# EAGLE design EXDOS rev3.7 (EAGLE 7.5.0)
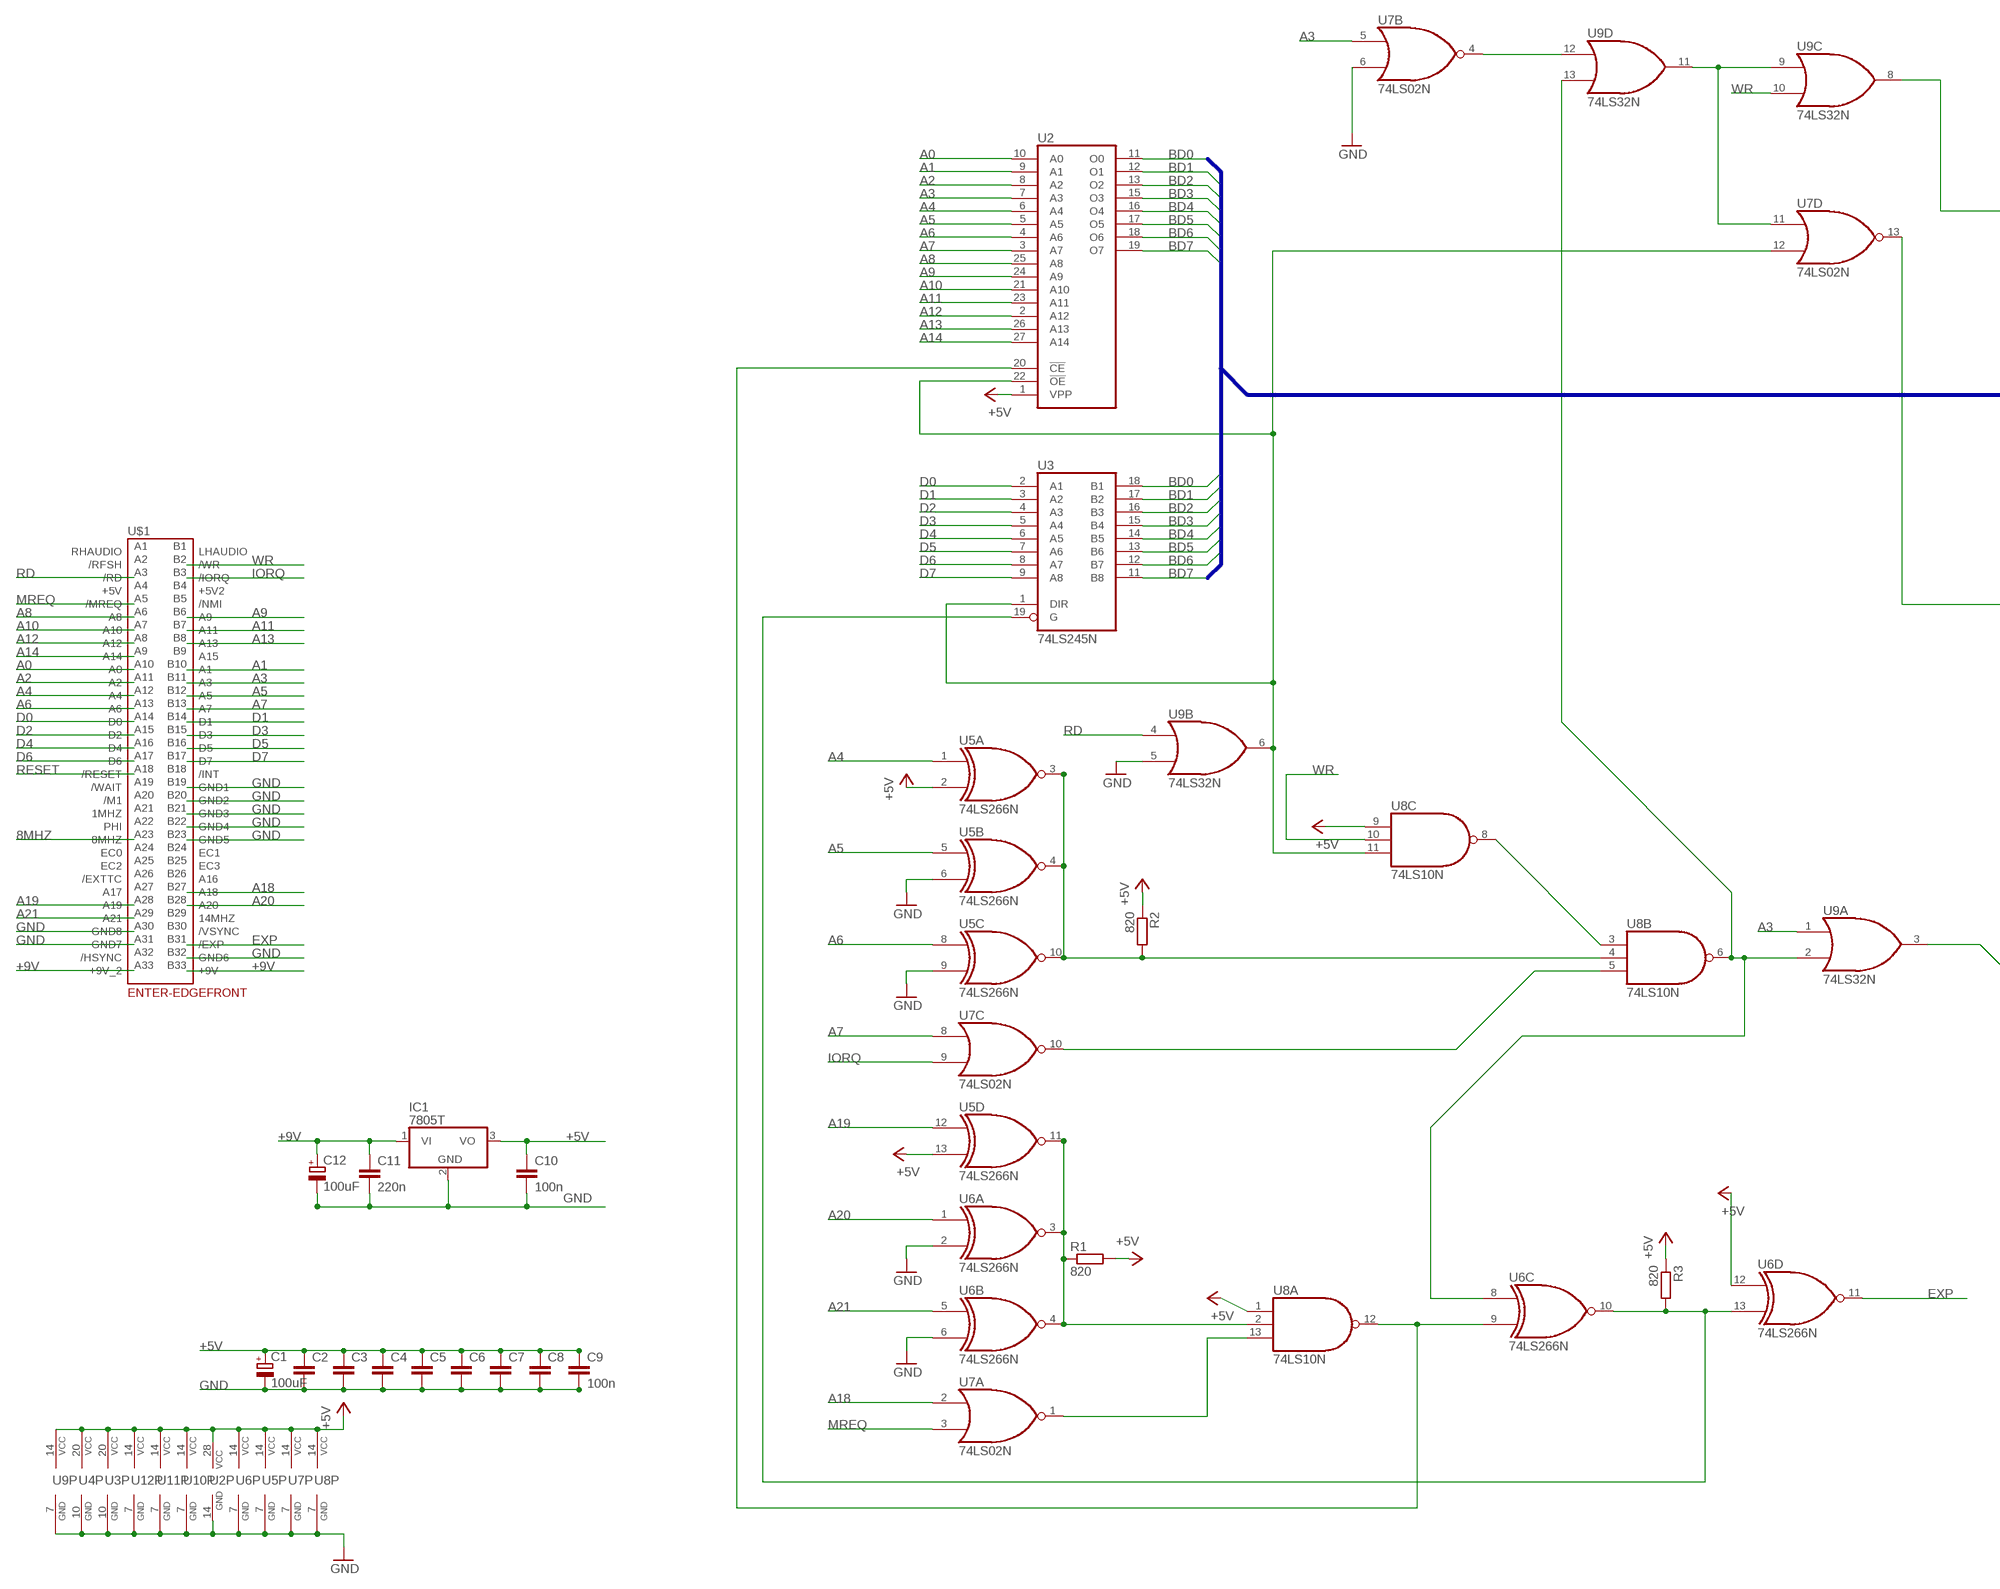
[diagram p0: schematic, sheet 1, part 1 of 2]
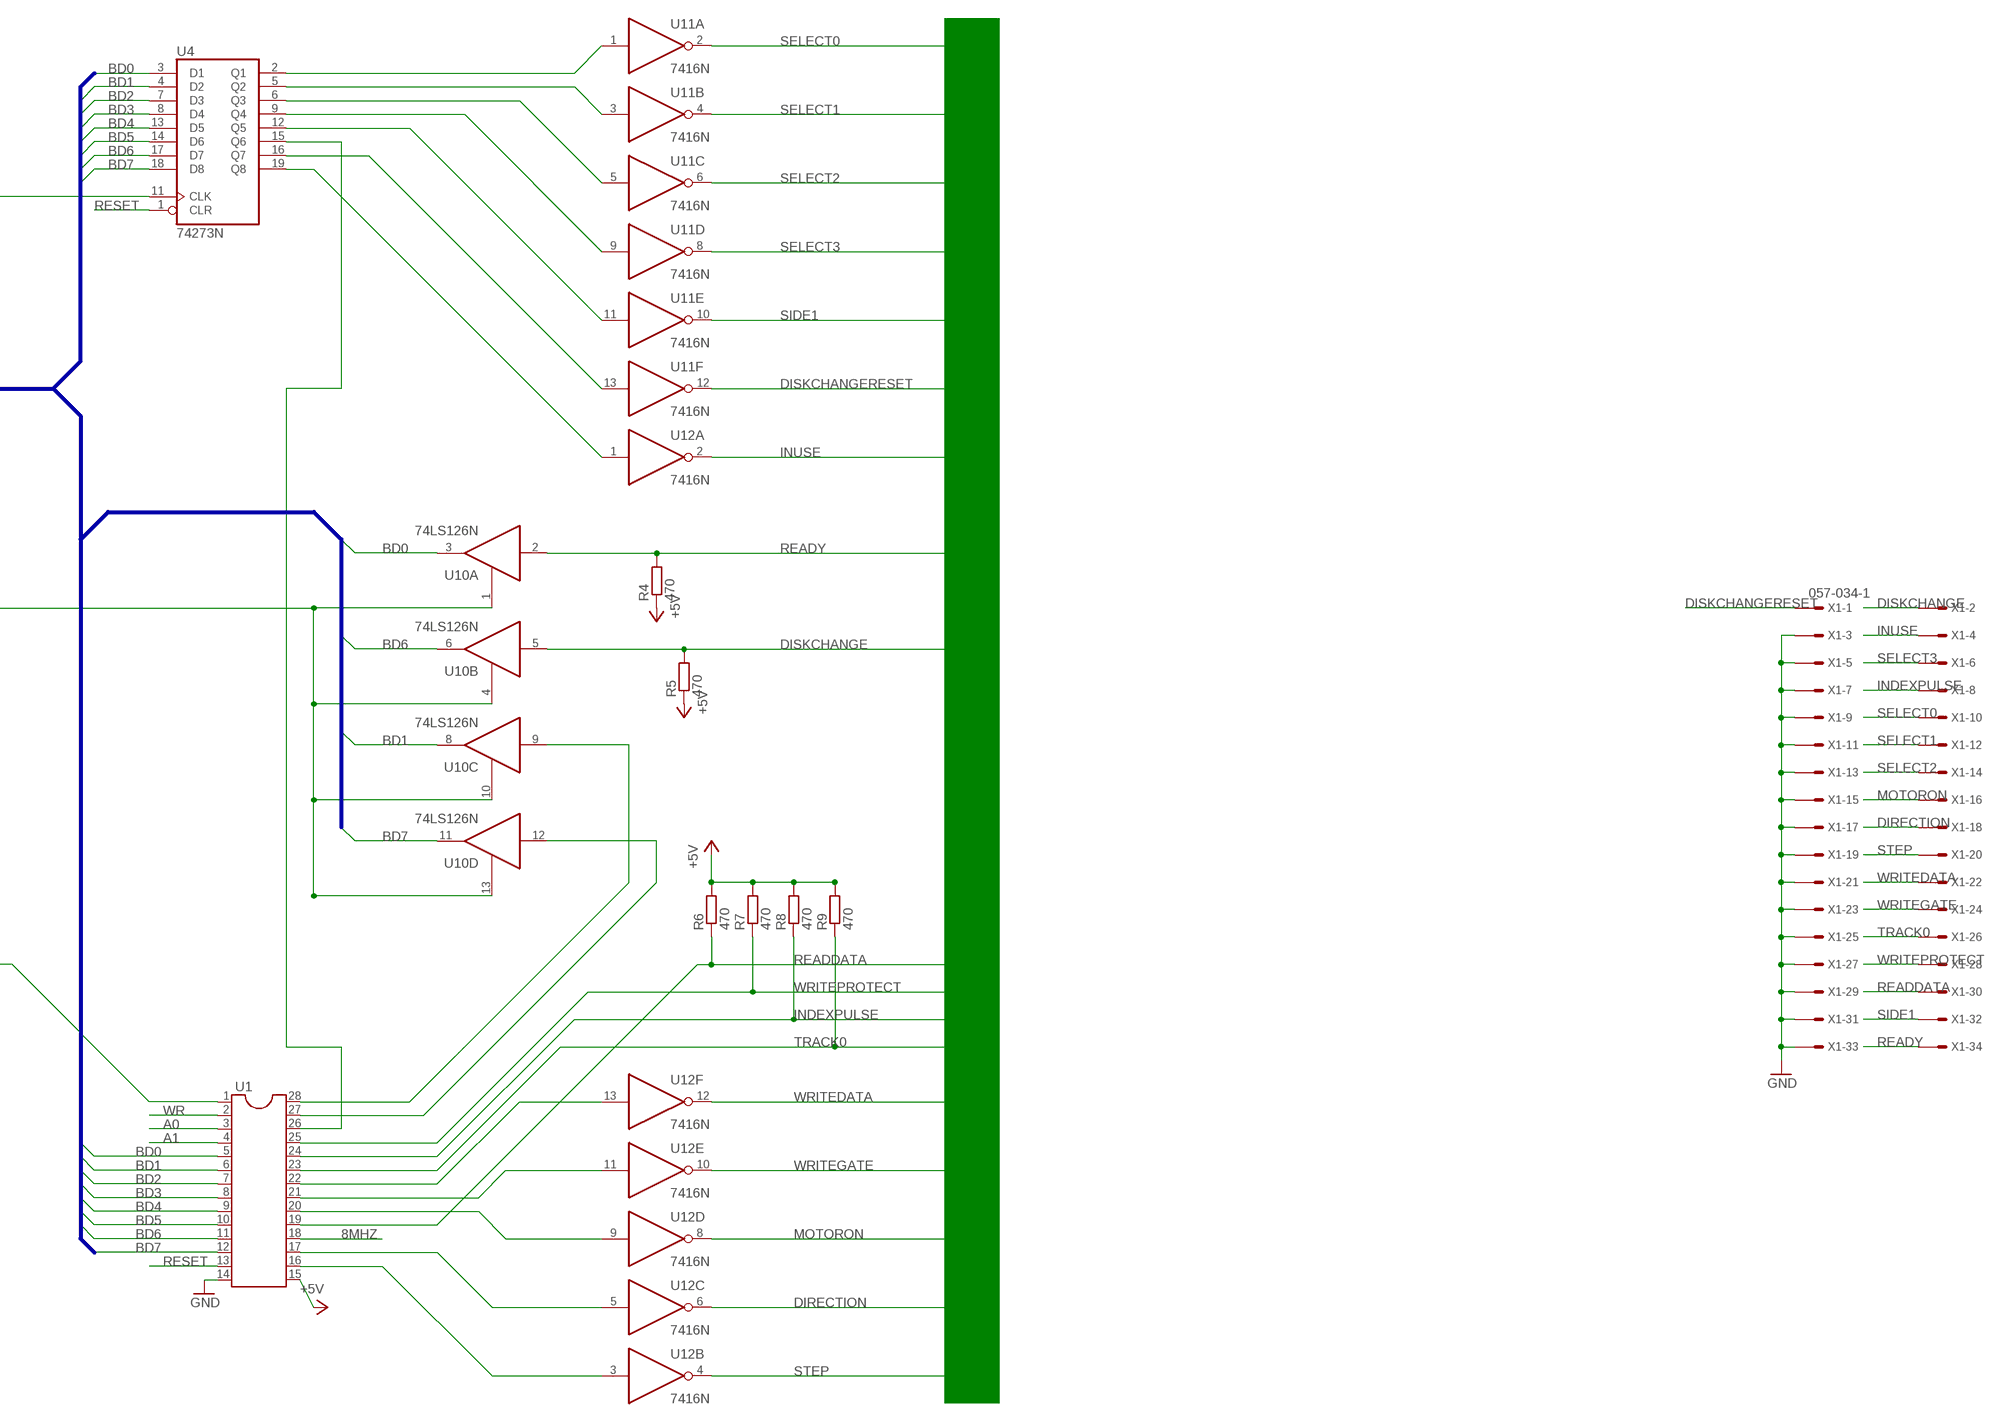
[diagram p1: schematic, sheet 1, part 2 of 2]

## Parts
C1  100uF  CPOL-EUE1.8-4  [E1,8-4]
C2  C-EU025-025X050  [C025-025X050]
C3  C-EU025-025X050  [C025-025X050]
C4  C-EU025-025X050  [C025-025X050]
C5  C-EU025-025X050  [C025-025X050]
C6  C-EU025-025X050  [C025-025X050]
C7  C-EU025-025X050  [C025-025X050]
C8  C-EU025-025X050  [C025-025X050]
C9  100n  C-EU025-025X050  [C025-025X050]
C10  100n  C-EU025-025X050  [C025-025X050]
C11  220n  C-EU025-025X050  [C025-025X050]
C12  100uF  CPOL-EUE1.8-4  [E1,8-4]
IC1  7805T  [TO220H]
R1  820  R-EU_0207/10  [0207/10]
R2  820  R-EU_0207/10  [0207/10]
R3  820  R-EU_0207/10  [0207/10]
R4  470  R-EU_0207/10  [0207/10]
R5  470  R-EU_0207/10  [0207/10]
R6  470  R-EU_0207/10  [0207/10]
R7  470  R-EU_0207/10  [0207/10]
R8  470  R-EU_0207/10  [0207/10]
R9  470  R-EU_0207/10  [0207/10]
U1  DIL28  [DIL28-6]
U2  27256  [DIL28]
U3  74LS245N  [DIL20]
U4  74273N  [DIL20]
U5  74LS266N  [DIL14]
U6  74LS266N  [DIL14]
U7  74LS02N  [DIL14]
U8  74LS10N  [DIL14]
U9  74LS32N  [DIL14]
U10  74LS126N  [DIL14]
U11  7416N  [DIL14]
U12  7416N  [DIL14]
U$1  ENTER-EDGEFRONT  [ENTERPRISE-FRONT]
X1  057-034-1  [057-034-1]

## Nets
8MHZ: U1.18 U$1.A23(8MHZ)
+5V: C1.+ C2.1 C3.1 C4.1 C5.1 C6.1 C7.1 C8.1 C9.1 C10.1 IC1.3(VO) R1.2 R2.1 R3.1 R4.1 R5.1 R6.2 R7.2 R8.2 R9.2 U1.15 U2.1(VPP) U2.28(VCC) U3.20(VCC) U4.20(VCC) U5.2(A:I1) U5.13(D:I1) U5.14(P:VCC) U6.12(D:I0) U6.14(P:VCC) U7.14(P:VCC) U8.1(A:I0) U8.9(C:I0) U8.14(P:VCC) U9.14(P:VCC) U10.14(P:VCC) U11.14(P:VCC) U12.14(P:VCC)
+9V [POWER]: C11.1 C12.+ IC1.1(VI) U$1.A33(+9V_2) U$1.B33(+9V)
A0: U1.3 U2.10(A0) U$1.A10(A0)
A1: U1.4 U2.9(A1) U$1.B10(A1)
A2: U2.8(A2) U$1.A11(A2)
A3: U2.7(A3) U7.5(B:I0) U9.1(A:I0) U$1.B11(A3)
A4: U2.6(A4) U5.1(A:I0) U$1.A12(A4)
A5: U2.5(A5) U5.5(B:I0) U$1.B12(A5)
A6: U2.4(A6) U5.8(C:I0) U$1.A13(A6)
A7: U2.3(A7) U7.8(C:I0) U$1.B13(A7)
A8: U2.25(A8) U$1.A6(A8)
A9: U2.24(A9) U$1.B6(A9)
A10: U2.21(A10) U$1.A7(A10)
A11: U2.23(A11) U$1.B7(A11)
A12: U2.2(A12) U$1.A8(A12)
A13: U2.26(A13) U$1.B8(A13)
A14: U2.27(A14) U$1.A9(A14)
A18: U7.2(A:I0) U$1.B27(A18)
A19: U5.12(D:I0) U$1.A28(A19)
A20: U6.1(A:I0) U$1.B28(A20)
A21: U6.5(B:I0) U$1.A29(A21)
BD0: U1.5 U2.11(O0) U3.18(B1) U4.3(D1) U10.3(A:O)
BD1: U1.6 U2.12(O1) U3.17(B2) U4.4(D2) U10.8(C:O)
BD2: U1.7 U2.13(O2) U3.16(B3) U4.7(D3)
BD3: U1.8 U2.15(O3) U3.15(B4) U4.8(D4)
BD4: U1.9 U2.16(O4) U3.14(B5) U4.13(D5)
BD5: U1.10 U2.17(O5) U3.13(B6) U4.14(D6)
BD6: U1.11 U2.18(O6) U3.12(B7) U4.17(D7) U10.6(B:O)
BD7: U1.12 U2.19(O7) U3.11(B8) U4.18(D8) U10.11(D:O)
D0: U3.2(A1) U$1.A14(D0)
D1: U3.3(A2) U$1.B14(D1)
D2: U3.4(A3) U$1.A15(D2)
D3: U3.5(A4) U$1.B15(D3)
D4: U3.6(A5) U$1.A16(D4)
D5: U3.7(A6) U$1.B16(D5)
D6: U3.8(A7) U$1.A17(D6)
D7: U3.9(A8) U$1.B17(D7)
DIRECTION: U12.6(C:O) X1.18
DISKCHANGE: R5.2 U10.5(B:I) X1.2
DISKCHANGERESET: U11.12(F:O) X1.1
EXP: U6.11(D:O) U$1.B31(/EXP)
GND [POWER]: C1.- C2.2 C3.2 C4.2 C5.2 C6.2 C7.2 C8.2 C9.2 C10.2 C11.2 C12.- IC1.2(GND) U1.14 U2.14(GND) U3.10(GND) U4.10(GND) U5.6(B:I1) U5.7(P:GND) U5.9(C:I1) U6.2(A:I1) U6.6(B:I1) U6.7(P:GND) U7.6(B:I1) U7.7(P:GND) U8.7(P:GND) U9.5(B:I1) U9.7(P:GND) U10.7(P:GND) U11.7(P:GND) U12.7(P:GND) U$1.A30(GND8) U$1.A31(GND7) U$1.B19(GND1) U$1.B20(GND2) U$1.B21(GND3) U$1.B22(GND4) U$1.B23(GND5) U$1.B32(GND6) X1.3 X1.5 X1.7 X1.9 X1.11 X1.13 X1.15 X1.17 X1.19 X1.21 X1.23 X1.25 X1.27 X1.29 X1.31 X1.33
INDEXPULSE: R8.1 U1.24 X1.8
INUSE: U12.2(A:O) X1.4
IORQ: U7.9(C:I1) U$1.B3(/IORQ)
MOTORON: U12.8(D:O) X1.16
MREQ: U7.3(A:I1) U$1.A5(/MREQ)
N$1: U1.16 U12.3(B:I)
N$2: U1.17 U12.5(C:I)
N$3: R3.2 U3.19(G) U6.10(C:O) U6.13(D:I1)
N$5: R2.2 U5.3(A:O) U5.4(B:O) U5.10(C:O) U8.4(B:I1)
N$6: U7.10(C:O) U8.5(B:I2)
N$7: U1.28 U10.9(C:I)
N$8: U1.20 U12.9(D:I)
N$9: U4.2(Q1) U11.1(A:I)
N$10: U4.5(Q2) U11.3(B:I)
N$11: U4.6(Q3) U11.5(C:I)
N$12: U4.9(Q4) U11.9(D:I)
N$13: U4.12(Q5) U11.11(E:I)
N$14: U4.16(Q7) U11.13(F:I)
N$15: U4.19(Q8) U12.1(A:I)
N$16: U8.3(B:I0) U8.8(C:O)
N$17: U1.21 U12.11(E:I)
N$18: R1.1 U5.11(D:O) U6.3(A:O) U6.4(B:O) U8.2(A:I1)
N$19: U2.20(!CE) U6.9(C:I1) U8.12(A:O)
N$20: U7.1(A:O) U8.13(A:I2)
N$21: U1.22 U12.13(F:I)
N$22: U7.11(D:I0) U9.9(C:I0) U9.11(D:O)
N$23: U6.8(C:I0) U8.6(B:O) U9.2(A:I1) U9.13(D:I1)
N$24: U1.1 U9.3(A:O)
N$25: U4.11(CLK) U9.8(C:O)
N$26: U7.13(D:O) U10.1(A:OE) U10.4(B:OE) U10.10(C:OE) U10.13(D:OE)
N$27: U1.27 U10.12(D:I)
N$28: U2.22(!OE) U3.1(DIR) U7.12(D:I1) U8.11(C:I2) U9.6(B:O)
N$42: U7.4(B:O) U9.12(D:I0)
N$88: U1.26 U4.15(Q6)
RD: U9.4(B:I0) U$1.A3(/RD)
READDATA: R6.1 U1.19 X1.30
READY: R4.2 U10.2(A:I) X1.34
RESET: U1.13 U4.1(CLR) U$1.A18(/RESET)
SELECT0: U11.2(A:O) X1.10
SELECT1: U11.4(B:O) X1.12
SELECT2: U11.6(C:O) X1.14
SELECT3: U11.8(D:O) X1.6
SIDE1: U11.10(E:O) X1.32
STEP: U12.4(B:O) X1.20
TRACK0: R9.1 U1.23 X1.26
WR: U1.2 U8.10(C:I1) U9.10(C:I1) U$1.B2(/WR)
WRITEDATA: U12.12(F:O) X1.22
WRITEGATE: U12.10(E:O) X1.24
WRITEPROTECT: R7.1 U1.25 X1.28
Unconnected: U$1.A1(RHAUDIO) U$1.A2(/RFSH) U$1.A4(+5V) U$1.A19(/WAIT) U$1.A20(/M1) U$1.A21(1MHZ) U$1.A22(PHI) U$1.A24(EC0) U$1.A25(EC2) U$1.A26(/EXTTC) U$1.A27(A17) U$1.A32(/HSYNC) U$1.B1(LHAUDIO) U$1.B4(+5V2) U$1.B5(/NMI) U$1.B9(A15) U$1.B18(/INT) U$1.B24(EC1) U$1.B25(EC3) U$1.B26(A16) U$1.B29(14MHZ) U$1.B30(/VSYNC)

## Buses
BD0,BD1,BD2,BD3,BD4,BD5,BD6,BD7

## Library data of the parts
C1 C12 = rcl:CPOL-EU: POLARIZED CAPACITOR, European symbol
C2-C11 = rcl:C-EU: CAPACITOR, European symbol
IC1 = linear:78*: Positive VOLTAGE REGULATOR Source: http://cache.national.com/ds/LM/LM78L05.pdf http://www.fairchildsemi.com/ds/LM/LM7805.pdf
R1-R9 = rcl:R-EU_: RESISTOR, European symbol
U1 = ic-package:DIL28: Dual In Line
U2 = memory:27256: MEMORY
U3 = 74xx-us:74*245: Octal BUS TRANSCEIVER, 3-state
U4 = 74xx-us:74*273: Octal D type FLIP FLOP, clear
U5 U6 = 74xx-us:74*266: Quadruple EXCLUSIVE-NOR (XNOR), open-collector
U7 = 74xx-us:74*02: Quad 2-input NOR gate
U8 = 74xx-us:74*10: Triple 3-input NAND gate
U9 = 74xx-us:74*32: Quad 2-input OR gate
U10 = 74xx-us:74*126: Quad bus BUFFER, 3-state
U11 U12 = 74xx-us:74*16: Hex INVERTER, open collector, high-voltage
U$1 = yabus (enterprise):ENTER-EDGE
X1 = con-panduit:057-034-: CONNECTOR 34-pin series 057 contact pc board low profile headers; OC_FARNELL: unknown; OC_NEWARK: unknown

## Net classes
0 default: clearance 0.205 mm
1 POWER: width 0.3 mm

## Board
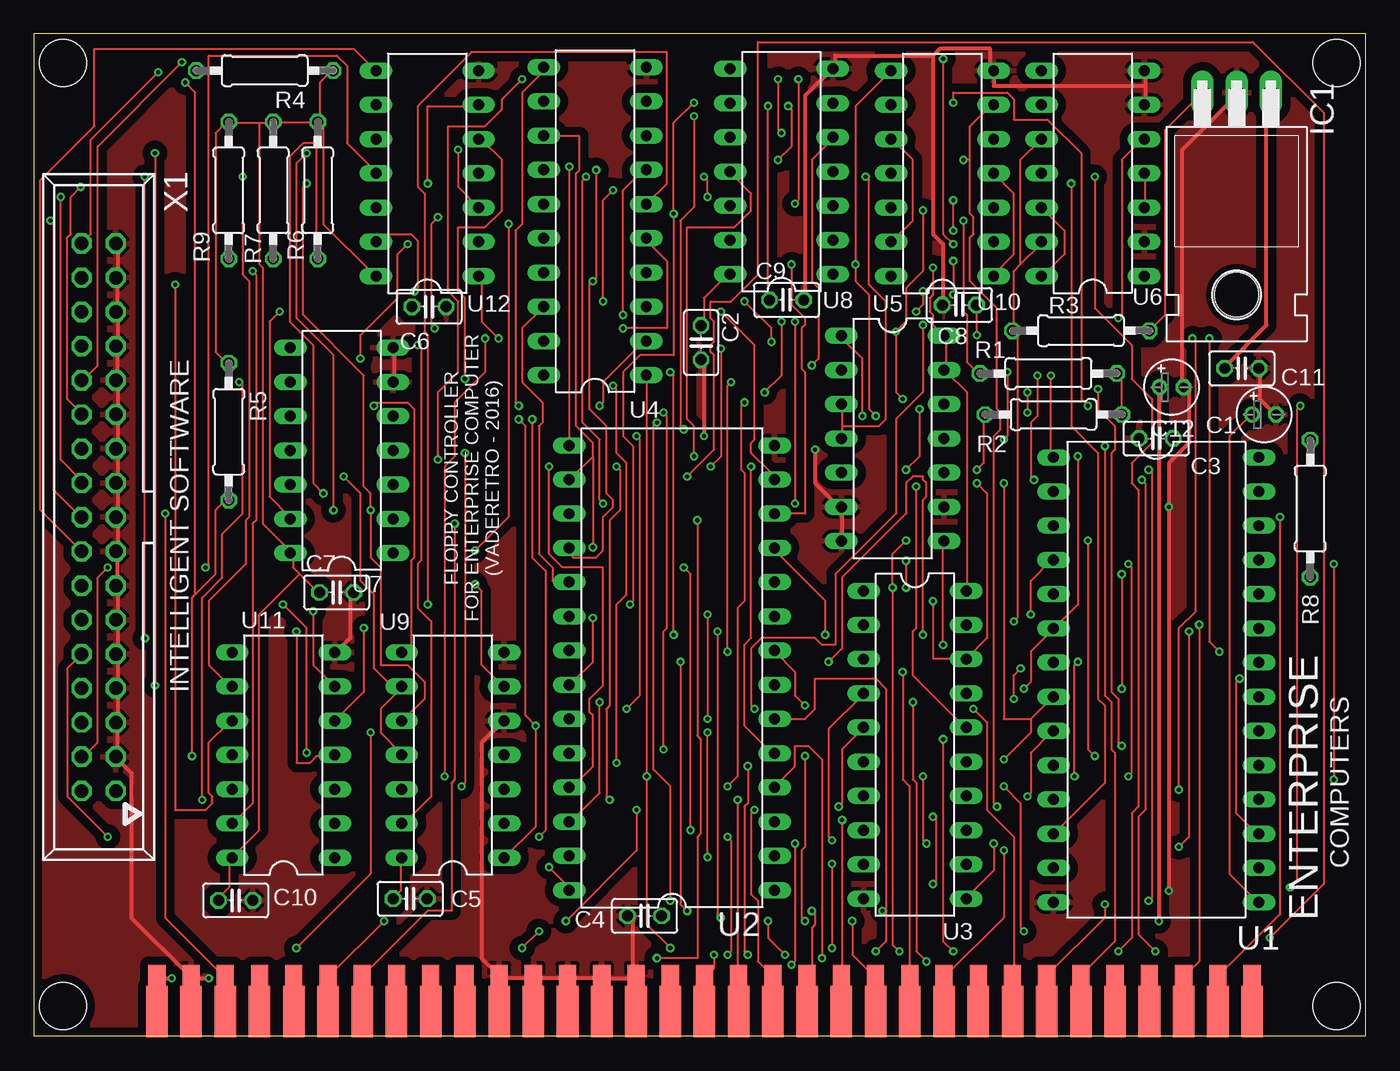
[diagram p2: board, top side]
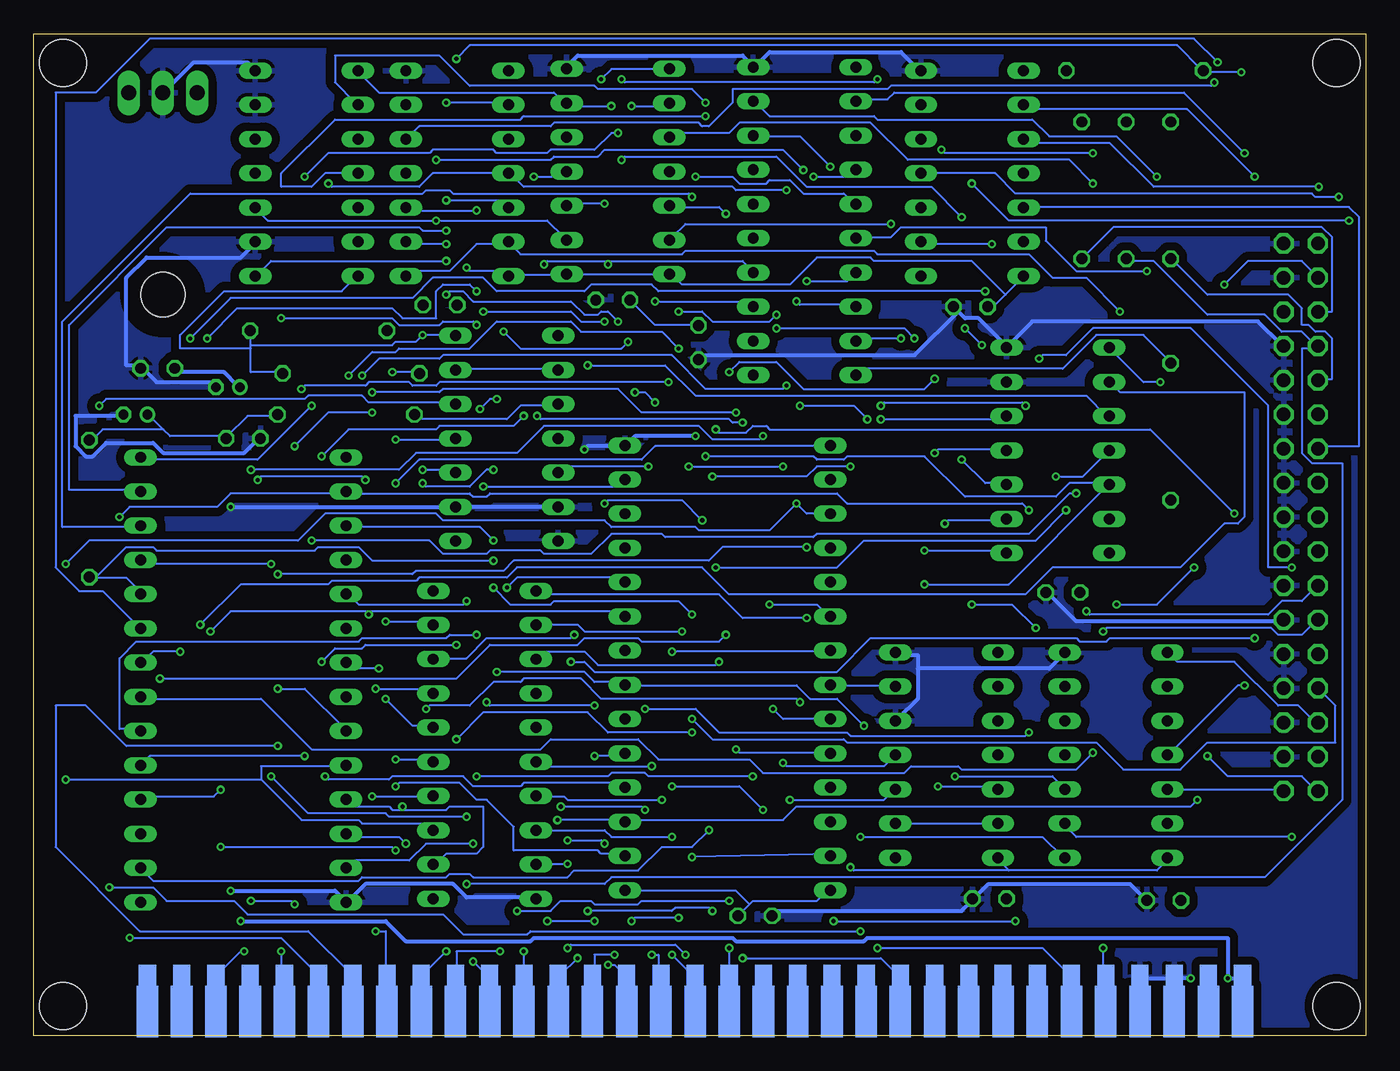
[diagram p3: board, bottom side, seen from below]

Size 98.87 x 74.37 mm. Coordinates in mm from the lower left corner, seen from the top.
Outline: 0,0 98.87,0 98.87,74.37 0,74.37 0,0
Copper layers (1*2*15*16): Top 0.035mm / dielectric 0.2mm / Route2 0.0175mm / dielectric 1.1mm / Route15 0.0175mm / dielectric 0.2mm / Bottom 0.035mm
Design rules "SeeedStudio_DRU_no_angle_20130527": minimum track width 6mil, minimum drill 12mil, track to track 6mil, track to pad 6mil, pad to pad 6mil, via to via 6mil, smd to smd 0mil, copper to edge 10mil, drill to drill 10mil, minimum pad ring 6mil, minimum via ring 6mil, stop-mask expansion 2mil, vias tented up to drill 25mil, thermal gap 10mil
Holes 3.5 mm at 2.19,2.19 2.19,72.19 96.69,72.19 96.69,2.19

### Footprints (pad centres in the part's own frame; a part is rotated, then mirrored left to right if it is on the bottom)
E1,8-4 = drill 0.711 pad 1.168: + -0.889,0 | drill 0.711 pad 1.168 octagon: - 0.889,0
C025-025X050 = drill 0.813 octagon: 1 -1.27,0; 2 1.27,0
TO220H = drill 1.118 long: 1 -2.54,-10.16; 2 0,-10.16; 3 2.54,-10.16 | hole 3.302: 0,4.826
0207/10 = drill 0.813 octagon: 1 -5.08,0; 2 5.08,0
DIL28-6 = drill 0.813 long: 1 -16.51,-7.62; 2 -13.97,-7.62; 3 -11.43,-7.62; 4 -8.89,-7.62; 5 -6.35,-7.62; 6 -3.81,-7.62; 7 -1.27,-7.62; 8 1.27,-7.62; 9 3.81,-7.62; 10 6.35,-7.62; 11 8.89,-7.62; 12 11.43,-7.62; 13 13.97,-7.62; 14 16.51,-7.62; 15 16.51,7.62; 16 13.97,7.62; 17 11.43,7.62; 18 8.89,7.62; 19 6.35,7.62; 20 3.81,7.62; 21 1.27,7.62; 22 -1.27,7.62; 23 -3.81,7.62; 24 -6.35,7.62; 25 -8.89,7.62; 26 -11.43,7.62; 27 -13.97,7.62; 28 -16.51,7.62
DIL28 = drill 0.813 long: 1 -16.51,-7.62; 2 -13.97,-7.62; 3 -11.43,-7.62; 4 -8.89,-7.62; 5 -6.35,-7.62; 6 -3.81,-7.62; 7 -1.27,-7.62; 8 1.27,-7.62; 9 3.81,-7.62; 10 6.35,-7.62; 11 8.89,-7.62; 12 11.43,-7.62; 13 13.97,-7.62; 14 16.51,-7.62; 15 16.51,7.62; 16 13.97,7.62; 17 11.43,7.62; 18 8.89,7.62; 19 6.35,7.62; 20 3.81,7.62; 21 1.27,7.62; 22 -1.27,7.62; 23 -3.81,7.62; 24 -6.35,7.62; 25 -8.89,7.62; 26 -11.43,7.62; 27 -13.97,7.62; 28 -16.51,7.62
DIL20 = drill 0.813 long: 1 -11.43,-3.81; 2 -8.89,-3.81; 3 -6.35,-3.81; 4 -3.81,-3.81; 5 -1.27,-3.81; 6 1.27,-3.81; 7 3.81,-3.81; 8 6.35,-3.81; 9 8.89,-3.81; 10 11.43,-3.81; 11 11.43,3.81; 12 8.89,3.81; 13 6.35,3.81; 14 3.81,3.81; 15 1.27,3.81; 16 -1.27,3.81; 17 -3.81,3.81; 18 -6.35,3.81; 19 -8.89,3.81; 20 -11.43,3.81
DIL14 = drill 0.813 long: 1 -7.62,-3.81; 2 -5.08,-3.81; 3 -2.54,-3.81; 4 0,-3.81; 5 2.54,-3.81; 6 5.08,-3.81; 7 7.62,-3.81; 8 7.62,3.81; 9 5.08,3.81; 10 2.54,3.81; 11 0,3.81; 12 -2.54,3.81; 13 -5.08,3.81; 14 -7.62,3.81
ENTERPRISE-FRONT = smd 1.27 x 1.905 bottom: A1 40.64,1.905; A2 38.1,1.905; A3 35.56,1.905; A4 33.02,1.905; A5 30.48,1.905; A6 27.94,1.905; A7 25.4,1.905; A8 22.86,1.905; A9 20.32,1.905; A10 17.78,1.905; A11 15.24,1.905; A12 12.7,1.905; A13 10.16,1.905; A14 7.62,1.905; A15 5.08,1.905; A16 2.54,1.905; A17 0,1.905; A18 -2.54,1.905; A19 -5.08,1.905; A20 -7.62,1.905; A21 -10.16,1.905; A22 -12.7,1.905; A23 -15.24,1.905; A24 -17.78,1.905; A25 -20.32,1.905; A26 -22.86,1.905; A27 -25.4,1.905; A28 -27.94,1.905; A29 -30.48,1.905; A30 -33.02,1.905; A31 -35.56,1.905; A32 -38.1,1.905; A33 -40.64,1.905 | smd 1.27 x 1.905: B1 40.64,1.905; B2 38.1,1.905; B3 35.56,1.905; B4 33.02,1.905; B5 30.48,1.905; B6 27.94,1.905; B7 25.4,1.905; B8 22.86,1.905; B9 20.32,1.905; B10 17.78,1.905; B11 15.24,1.905; B12 12.7,1.905; B13 10.16,1.905; B14 7.62,1.905; B15 5.08,1.905; B16 2.54,1.905; B17 0,1.905; B18 -2.54,1.905; B19 -5.08,1.905; B20 -7.62,1.905; B21 -10.16,1.905; B22 -12.7,1.905; B23 -15.24,1.905; B24 -17.78,1.905; B25 -20.32,1.905; B26 -22.86,1.905; B27 -25.4,1.905; B28 -27.94,1.905; B29 -30.48,1.905; B30 -33.02,1.905; B31 -35.56,1.905; B32 -38.1,1.905; B33 -40.64,1.905 | smd 1.6 x 3.81 bottom: SA1 40.64,-0.635; SA2 38.1,-0.635; SA3 35.56,-0.635; SA4 33.02,-0.635; SA5 30.48,-0.635; SA6 27.94,-0.635; SA7 25.4,-0.635; SA8 22.86,-0.635; SA9 20.32,-0.635; SA10 17.78,-0.635; SA11 15.24,-0.635; SA12 12.7,-0.635; SA13 10.16,-0.635; SA14 7.62,-0.635; SA15 5.08,-0.635; SA16 2.54,-0.635; SA17 0,-0.635; SA18 -2.54,-0.635; SA19 -5.08,-0.635; SA20 -7.62,-0.635; SA21 -10.16,-0.635; SA22 -12.7,-0.635; SA23 -15.24,-0.635; SA24 -17.78,-0.635; SA25 -20.32,-0.635; SA26 -22.86,-0.635; SA27 -25.4,-0.635; SA28 -27.94,-0.635; SA29 -30.48,-0.635; SA30 -33.02,-0.635; SA31 -35.56,-0.635; SA32 -38.1,-0.635; SA33 -40.64,-0.635 | smd 1.6 x 3.81: SB1 40.64,-0.635; SB2 38.1,-0.635; SB3 35.56,-0.635; SB4 33.02,-0.635; SB5 30.48,-0.635; SB6 27.94,-0.635; SB7 25.4,-0.635; SB8 22.86,-0.635; SB9 20.32,-0.635; SB10 17.78,-0.635; SB11 15.24,-0.635; SB12 12.7,-0.635; SB13 10.16,-0.635; SB14 7.62,-0.635; SB15 5.08,-0.635; SB16 2.54,-0.635; SB17 0,-0.635; SB18 -2.54,-0.635; SB19 -5.08,-0.635; SB20 -7.62,-0.635; SB21 -10.16,-0.635; SB22 -12.7,-0.635; SB23 -15.24,-0.635; SB24 -17.78,-0.635; SB25 -20.32,-0.635; SB26 -22.86,-0.635; SB27 -25.4,-0.635; SB28 -27.94,-0.635; SB29 -30.48,-0.635; SB30 -33.02,-0.635; SB31 -35.56,-0.635; SB32 -38.1,-0.635; SB33 -40.64,-0.635
057-034-1 = drill 1 octagon: 1 -20.32,-1.27; 2 -20.32,1.27; 3 -17.78,-1.27; 4 -17.78,1.27; 5 -15.24,-1.27; 6 -15.24,1.27; 7 -12.7,-1.27; 8 -12.7,1.27; 9 -10.16,-1.27; 10 -10.16,1.27; 11 -7.62,-1.27; 12 -7.62,1.27; 13 -5.08,-1.27; 14 -5.08,1.27; 15 -2.54,-1.27; 16 -2.54,1.27; 17 0,-1.27; 18 0,1.27; 19 2.54,-1.27; 20 2.54,1.27; 21 5.08,-1.27; 22 5.08,1.27; 23 7.62,-1.27; 24 7.62,1.27; 25 10.16,-1.27; 26 10.16,1.27; 27 12.7,-1.27; 28 12.7,1.27; 29 15.24,-1.27; 30 15.24,1.27; 31 17.78,-1.27; 32 17.78,1.27; 33 20.32,-1.27; 34 20.32,1.27

### Placement (x,y rotation side)
C1  91.31,46.1 0 top
C2  49.53,51.44 270 top
C3  83.31,44.32 180 top
C4  45.34,8.89 180 top
C5  27.94,10.16 0 top
C6  29.34,54.1 0 top
C7  22.48,32.89 0 top
C8  68.71,54.23 180 top
C9  55.88,54.61 0 top
C10  14.99,10.03 0 top
C11  89.66,49.53 0 top
C12  84.45,48.13 0 top
IC1  89.28,59.82 180 top
R1  75.31,49.15 0 top
R2  75.69,46.1 180 top
R3  77.72,52.32 180 top
R4  17.14,71.63 180 top
R5  14.48,44.83 270 top
R6  21.08,62.74 90 top
R7  17.78,62.74 90 top
R8  94.74,39.12 90 top
R9  14.48,62.74 90 top
U1  83.31,26.42 270 top
U2  47.37,27.3 90 top
U3  65.41,21.59 270 top
U4  41.66,60.45 90 top
U5  63.75,44.32 270 top
U6  78.61,64.01 90 top
U7  22.86,43.43 90 top
U8  55.5,64.14 90 top
U9  31.11,20.83 90 top
U10  67.44,64.01 90 top
U11  18.54,20.83 90 top
U12  29.21,64.01 90 top
U$1  49.78,2.41 0 top
X1  4.83,38.48 90 top

### Tracks (layer width: path | path; a pad name or v marks a point on that pad's centre or on a via)
8MHZ  (via drill 0.3)
  Top 0.152: v46.25,5.75 49.25,5.75 49.25,14.75 49.5,15 49.5,22 49.25,22.25 v49.25,38.25 | v56.5,53 v56.5,39.5 | v65.5,53.75 66,54.25 v66,55.25 | v86,51.75 86.25,51.5 86.25,31.5 85,30.25 v85,18.25
  Bottom 0.152: v46.25,5.75 36,5.75 34.75,4.5 U$1.A23 | v49.25,38.25 50.75,39.75 56.25,39.75 v56.5,39.5 | v56.5,53 58.25,53 59,53.75 v65.5,53.75 | v66,55.25 66.5,55.75 68.5,55.75 69,55.25 69,53.25 71.5,53.25 72.25,54 83.75,54 v86,51.75 | v85,18.25 85.5,17.75 90.75,17.75 U1.18
+5V  (via drill 0.3)
  Top 0.152: U1.15 90.75,10 88.75,12 88.75,44.5 90.25,46 C1.+ | 69.25,33 U3.20 69.25,33.25 69.25,47.75 67.75,49.25 U5.13 67.75,49.5 67.75,51.75 U5.14 67.5,52 66.75,52.75 66.75,53.5 66.5,53.75 66.5,54.75 66.75,55 v66.75,57 | v70,52 70,54 C8.1 | U6.14 75,56.5 76.5,58 76.5,59.75 75,61.25 U6.12 | R1.2 80.5,49 80.75,48.75 80.75,46.25 R2.1 | IC1.3 86.5,69.75 84,67.25 84,53.5 83,52.5 R3.1 | 19.75,34.25 19.25,34.75 19.25,35.75 U7.14 19,36 17,38 17,57 16.75,57.25 16.75,67.75 | 19.75,34.25 21,33 C7.1 | C5.1 26.75,10.25 27.25,10.75 27.25,13 U9.14 27.5,13.25 | C10.1 13.75,10.25 14.5,11 14.5,13 U11.14 14.75,13.25 16.75,15.25 16.75,31.25 19.75,34.25 | v38.25,12.5 39.75,11 U2.28 | 63.75,56.5 U10.14 | C2.1 49.75,52.75 49.75,54.75 51.5,56.5 U8.14 | v54.5,69 54.5,54.75 C9.1 | 25.5,56.5 U12.14 25.25,56.5 21.5,60.25 21.5,67.5 21.25,67.75 R6.2 | R6.2 21,67.75 18,67.75 R7.2 17.75,67.75 16.75,67.75 | R4.1 22,71.5 21.25,70.75 21.25,68 R6.2 | 38,49 U4.20 | R5.1 14.25,50 13.5,50.75 13.5,67 14.25,67.75 R9.2 14.5,67.75 16.75,67.75
  Bottom 0.152: 89.25,45 88.75,44.5 84.75,44.5 C3.1 84.5,44.5 83,46 81,46 R2.1 | 89.25,45 90.25,46 C1.+ | 89.25,45 93.75,45 94.5,44.25 R8.2 | U5.2 60,49.5 67.5,49.5 U5.13 | U5.14 67.75,52 v70,52 70.5,51.5 72,51.5 72.25,51.25 82.75,51.25 | 82.75,51 82.75,49.25 80.5,49.25 R1.2 | 82.75,51 82.75,51.25 | 82.75,51.25 82.75,52.25 R3.1 | 82.75,51 88,51 88,52 84.75,55.25 76,55.25 75,56.25 U6.14 | 45.75,9.75 46.5,9 C4.1 | 45.75,9.75 45.5,10 40.75,10 40,10.75 U2.28 | 45.75,9.75 46.75,10.75 54.75,10.75 U2.1 | 26.5,12.25 27.25,13 U9.14 | 26.5,12.25 15.5,12.25 14.75,13 U11.14 | v38.25,12.5 38,12.25 26.5,12.25 | C9.1 52.75,52.75 49.75,52.75 C2.1 | v54.5,69 51.75,69 U8.9 | 26.75,55 27.5,54.25 28,54.25 C6.1 | 26.75,55 25.5,56.25 U12.14 | U4.20 37.75,49.25 37.5,49.5 22.5,49.5 20,52 16.5,52 14.5,50 R5.1 | 26.75,55 29.25,57.5 36.5,57.5 36.75,57.75 40.75,57.75 42.75,55.75 50.75,55.75 51.5,56.5 U8.14 51.75,56.5 59.25,56.5 U8.1 59.5,56.5 63.5,56.5 U10.14 63.75,56.5 64,56.75 66.5,56.75 v66.75,57
+9V  (via drill 0.3)
  Top 0.3: v10.25,4.25 9.25,4.25 U$1.B33 | v83.5,8.5 83.5,48 C12.+ | IC1.1 91.75,69.75 91.5,69.5 91.5,52.75 88.5,49.75 C11.1
  Bottom 0.3: U$1.B33 9.25,4.25 v10.25,4.25 10.25,7.25 37,7.25 37.25,7 46.75,7 47,7.25 61.75,7.25 62,7 71.25,7 72.75,8.5 v83.5,8.5 | C11.1 88.25,49.5 88,49.25 84.75,49.25 83.75,48.25 C12.+
A0  (via drill 0.3)
  Top 0.152: v64.25,6.25 63.75,6.75 v63.75,33.25 63.75,35.75 v64.75,36.75
  Bottom 0.152: v64.25,6.25 67.5,6.25 67.5,4.5 U$1.A10 | v63.75,33.25 63,34 55.25,34 55,33.75 U2.10 | v64.75,36.75 65.75,37.75 75.5,37.75 U1.3
A1  (via drill 0.3)
  Top 0.152: v72,13.75 72,8.75 67.75,4.5 U$1.B10 | v85,14 85.75,14.75 v85.75,30 | v74,31.25 74,33.75 75.5,35.25 U1.4
  Bottom 0.152: v72,13.75 72.25,14 v85,14 | v85.75,30 84.25,31.5 74,31.5 | 74,31.5 55.25,31.5 55,31.25 U2.9 | 74,31.5 v74,31.25
A2  (via drill 0.3)
  Top 0.152: v66.25,5.5 65.5,6.25 65.5,18.75 65.25,19 v65.25,24.75 | v57.25,24.5 56.5,25.25 56.5,27 55,28.5 U2.8
  Bottom 0.152: v66.25,5.5 65.25,4.5 U$1.A11 | v65.25,24.75 65,24.5 v57.25,24.5
A3  (via drill 0.3)
  Top 0.152: v64.5,27 64.5,19 65,18.5 65,4.5 U$1.B11 | U9.1 35,13.25 37.25,15.5 v37.25,23 36.5,23.75 36.5,45.25 v36,45.75
  Bottom 0.152: v64.5,27 58,27 57.25,26.25 55,26.25 U2.7 54.75,26 42.25,26 41.25,25 39.25,25 v37.25,23 | v36,45.75 26.75,45.75 U7.5
A4  (via drill 0.3)
  Top 0.152: v62.5,6.25 63.25,7 63.25,9.25 | 63.25,9.25 63.25,25.75 62.5,26.5 58,26.5 58,24.25 57.25,23.5 U2.6 | v61.5,46 61.5,50.25 60,51.75 U5.1 | v46.25,45.5 46,45.25 46,19.75 47.25,18.5 v47.25,10 | 63.25,9.25 v63,9.25
  Bottom 0.152: v62.5,6.25 62.5,4.5 U$1.A12 | v61.5,46 61.25,45.75 47.25,45.75 47,45.5 v46.25,45.5 | v47.25,10 53.75,10 54,9.75 57.25,9.75 57.5,10 59.75,10 60.5,9.25 v63,9.25
A5  (via drill 0.3)
  Top 0.152: v60.75,8.5 60.75,6 62.25,4.5 U$1.B12 | v57.25,8.5 57,8.75 57,13.75 57.25,14 v57.25,20.75 | v53.25,42.25 53.25,29.5 52.75,29 52.75,23 54.75,21 U2.5
  Bottom 0.152: v57.25,8.5 v60.75,8.5 | v57.25,20.75 55,20.75 U2.5 | v53.25,42.25 59.5,42.25 59.75,42 U5.5
A6  (via drill 0.3)
  Top 0.152: v58.5,5.75 58.5,20.5 57.5,21.5 56.5,21.5 56.5,20 55,18.5 U2.4 | v67.5,29 67.5,36.5 U5.8 | v77.5,27.75 77.25,27.5 v77.25,19.25
  Bottom 0.152: v58.5,5.75 59.75,4.5 U$1.A13 | v67.5,29 74.25,29 74.5,28.75 76.5,28.75 v77.5,27.75 | v77.25,19.25 77,19 72.5,19 72.25,19.25 67,19.25 66.25,18.5 62.75,18.5 62.5,18.75 55.25,18.75 55,18.5 U2.4
A7  (via drill 0.3)
  Top 0.152: v60,16 60,4.5 U$1.B13 | v15.25,48.5 15.5,48.25 15.5,38.75 14,37.25 14,34 12.5,32.5 v12.5,17.5
  Bottom 0.152: v60,16 55,16 U2.3 54.75,16 43.25,16 42.25,17 13,17 v12.5,17.5 | v15.25,48.5 16.5,48.5 19,51 U7.8
A8  (via drill 0.3)
  Top 0.152: v91.75,7.25 95.75,11.25 95.75,68.5 90.5,73.75 53.75,73.75 53.75,56.5 51.75,54.5 50.25,54.5 50.25,53.25 50.5,53 50.5,51.5 50.25,51.25 50.25,50.75 50.5,50.5 50.5,43.5 v48.5,41.5 | v38.25,42.25 38.25,35.75 39.25,34.75 42.25,34.75 42.25,26 41.25,25 41.25,24 41.5,23.75 41.5,20 40,18.5 U2.25
  Bottom 0.152: v91.75,7.25 80.5,7.25 77.75,4.5 U$1.A6 | v48.5,41.5 41.5,41.5 40.75,42.25 v38.25,42.25
A9  (via drill 0.3)
  Top 0.152: v79.5,43.75 79.5,25.25 80,24.75 80,21.25 80.25,21 80.25,7 77.75,4.5 U$1.B6 | v73.75,47.75 v73.75,46.25 | v46.75,46.25 47,46 47,30.25 46.75,30 v46.75,21.25
  Bottom 0.152: v79.5,43.75 77,46.25 v73.75,46.25 | v73.75,47.75 68.75,47.75 68.5,48 55.5,48 53.75,46.25 v46.75,46.25 | v46.75,21.25 46.5,21 40,21 U2.24
A10  (via drill 0.3)
  Top 0.152: v80.75,21.5 80.5,21.75 80.5,25 80,25.5 80,43.25 80.25,43.5 80.25,45.25 79,46.5 v79,48 | v51.75,48.5 51.5,48.25 v51.5,28.5
  Bottom 0.152: v80.75,21.5 92,21.5 95,24.5 97.25,24.5 97.25,14 91,7.75 78.5,7.75 75.25,4.5 U$1.A7 | v79,48 78.75,48.25 74.25,48.25 74,48.5 71,48.5 70.75,48.25 69,48.25 68.75,48.5 v51.75,48.5 | v51.5,28.5 40,28.5 U2.21
A11  (via drill 0.3)
  Top 0.152: v79.5,9.75 79.5,8.75 75.25,4.5 U$1.B7 | v82.75,10 83,10.25 83,41.75 v82.75,42 | v44.75,44.5 45,44.25 45,25.25 v44,24.25
  Bottom 0.152: v79.5,9.75 79.75,10 v82.75,10 | v82.75,42 71.75,42 70.5,43.25 63,43.25 61,45.25 49.5,45.25 48.5,44.25 45,44.25 v44.75,44.5 | v44,24.25 43.25,23.5 40,23.5 U2.23
A12  (via drill 0.3)
  Top 0.152: v73.5,7.75 73.25,8 73.25,17.25 v72,18.5
  Bottom 0.152: v73.5,7.75 72.75,7.75 72.75,4.5 U$1.A8 | v72,18.5 71.75,18.75 67.25,18.75 66,17.5 65.25,17.5 63.25,15.5 63.25,13.75 57,13.75 56.75,13.5 55,13.5 U2.2
A13  (via drill 0.3)
  Top 0.152: v69.75,24.25 70.75,23.25 70.75,16.75 72.75,14.75 72.75,4.5 U$1.B8 | v42,24.75 42,18 40,16 U2.26
  Bottom 0.152: v69.75,24.25 69.5,24.5 66.5,24.5 64.75,26.25 62.75,26.25 62.5,26.5 58.25,26.5 56.75,25 42.25,25 v42,24.75
A14  (via drill 0.3)
  Top 0.152: v68.25,6.25 67.5,7 v67.5,22 | v50,13.25 v50,22.5
  Bottom 0.152: v68.25,6.25 70,4.5 U$1.A9 | v67.5,22 65.5,24 57.75,24 56.25,22.5 v50,22.5 | v50,13.25 39.24,13.5 U2.27
A18  (via drill 0.3)
  Top 0.152: v31.25,38 31.25,19 31,18.75 31,9.25 29.25,9.25 24.5,4.5 U$1.B27
  Bottom 0.152: v31.25,38 31,38.25 26.75,38.25 U7.2
A19  (via drill 0.3)
  Top 0.152: v37.5,7.75 v36.25,6.5 | v93.25,11 93.75,11.5 93.75,46.5 v94,46.75
  Bottom 0.152: v36.25,6.5 24,6.5 22,4.5 U$1.A28 | v37.5,7.75 62,7.75 62.25,7.5 67,7.5 68.5,9 83,9 84,10 89,10 90,11 v93.25,11 | v94,46.75 93.5,47.25 78.75,47.25 78.5,47.5 74.5,47.5 74,47 67.75,47 U5.12
A20  (via drill 0.3)
  Top 0.152: v26,8.5 22,4.5 U$1.B28 | v39.5,8.5 44.75,13.75 v44.75,16.75 | v51.5,18.5 52.25,19.25 52.25,31.75 52.75,32.25 52.75,41.75 52.5,42 52.5,46.75 v52.75,47 | v54.25,47.75 55.5,49 v55.5,53 | v68.25,57.5 v68.25,55
  Bottom 0.152: v39.5,8.5 v26,8.5 | v44.75,16.75 46.5,18.5 v51.5,18.5 | v52.75,47 53.5,47.75 v54.25,47.75 | v55.5,53 56.25,53.75 56.75,53.75 57,53.5 58,53.5 59,54.5 66.25,54.5 67,55.25 68,55.25 v68.25,55 | v68.25,57.5 81.25,57.5 82.25,56.5 U6.1
A21  (via drill 0.3)
  Top 0.152: v19.5,6.5 25,12 v25,22.5 | v53.5,24.25 53.25,24.5 53.25,28.75 54,29.5 58,29.5 58.5,29 59.5,29 59.5,34.25 64,38.75 64,45.75 66,47.75 v66,52.75 | v80.5,53.25 80.75,53.5 80.75,65 82.25,66.5 U6.5
  Bottom 0.152: v19.5,6.5 19.5,4.5 U$1.A29 | v25,22.5 25.25,22.25 38.25,22.25 38.5,22.5 48,22.5 49.75,24.25 v53.5,24.25 | v66,52.75 66.25,53 68.5,53 68.75,52.75 71.75,52.75 72.25,53.25 v80.5,53.25
BD0  (via drill 0.3)
  Top 0.152: v66.75,32.25 66.75,28 69,28 U3.18 69.25,28 70.75,29.5 70.75,40.25 v70,41 | v58.75,29.75 58.75,32.25 55,36 U2.11 | v52.75,54.5 54.75,52.5 v54.75,51.5 | v66,61.25 66,56.75 64.75,55.5 64.75,53 v64,52.25 64,47.75 v64.5,47.25 | v64.75,42 65.75,43 v65.75,46.5
  Bottom 0.152: v66.75,32.25 67,32 74.75,32 75.5,32.75 U1.5 | v58.75,29.75 59,29.5 65.25,29.5 66.75,28 69,28 U3.18 | v52.75,54.5 45.75,54.5 45.5,54.25 U4.3 | v54.75,51.5 55.25,51 62.75,51 v64,52.25 | v66,61.25 71,61.25 U10.3 | v70,41 69.75,40.75 66.5,40.75 65.25,42 v64.75,42 | v65.75,46.5 65,47.25 v64.5,47.25
BD1  (via drill 0.3)
  Top 0.152: v73.5,25.75 74,26.25 74,28.5 75.5,30 U1.6 75.75,30.25 77.5,32 v77.5,43 | U10.8 63.5,71.5 61,69 v61,57.25 61,56 62,55 62,46.5 v62.5,46 | v56.25,57.25 56.25,54.25 57.25,53.25 57.25,52.75 57,52.5 57,49.5 57.25,49.25 57.25,38.75 55,38.75 U2.12
  Bottom 0.152: v73.5,25.75 69.5,25.75 69.25,25.5 U3.17 | 56.25,57.5 60.75,57.5 v61,57.25 | 56.25,57.5 46.25,57.5 45.5,56.75 U4.4 | 56.25,57.5 v56.25,57.25 | v77.5,43 75.5,45 69,45 68.75,45.25 63.25,45.25 v62.5,46
BD2  (via drill 0.3)
  Top 0.152: v65.5,40.75 65.5,30.25 65.25,30 65.25,26.75 69,23 U3.16 | v43.75,53.5 43.75,62.75 45.25,64.25 U4.7 | v51,53.75 53.5,51.25 53.5,44.25 53.25,44 53.25,43.25 54.75,41.75 54.75,41.5 U2.13 | v73.25,27.25 72.75,26.75 v72.75,25
  Bottom 0.152: v65.5,40.75 55.5,40.75 55,41.25 U2.13 | v43.75,53.5 44.25,53 48.5,53 49.25,53.75 v51,53.75 | v73.25,27.25 75.25,27.25 75.5,27.5 U1.7 | v72.75,25 70.75,23 69.25,23 U3.16
BD3  (via drill 0.3)
  Top 0.152: v72,20.5 74,22.5 74,23.5 | 74,23.5 75.5,25 U1.8 | v39.75,64.5 39.75,44 U2.15 | 74,23.5 72,23.5 v72,41
  Bottom 0.152: v72,20.5 69.25,20.5 U3.15 | v39.75,64.5 42,66.75 45.25,66.75 U4.8 | v72,41 70.25,42.75 53.75,42.75 52.75,43.75 40,43.75 U2.15
BD4  (via drill 0.3)
  Top 0.152: v73.75,17.75 74,18 74,21 75.5,22.5 U1.9 | 41.5,43 41.5,44 40.25,45.25 40.25,64 40.5,64.25 40.5,66.75 38,66.75 U4.13 | 41.5,43 40,41.5 U2.16 | v80.75,34.25 v80.75,25.75 | 41.5,43 v41.5,36.25
  Bottom 0.152: v73.75,17.75 69.25,17.75 U3.14 | v80.75,25.75 78.75,25.75 75.75,22.75 U1.9 | v80.75,34.25 70.75,34.25 70.5,34.5 64,34.5 63.25,35.25 48.75,35.25 47.75,36.25 v41.5,36.25
BD5  (via drill 0.3)
  Top 0.152: v41,63.75 40.75,63.5 40.75,45.5 42,44.25 42,39.75 v42.25,39.5 | v96.5,35 v96.5,19
  Bottom 0.152: 82,19 79,16 74.75,16 74.5,15.75 69.75,15.75 69.25,15.25 U3.13 | 82,19 82,20 75.75,20 U1.10 | v41,63.75 38.5,63.75 38,64.25 U4.14 | U2.17 40,38.75 41.5,38.75 v42.25,39.5 44.25,37.5 49.5,37.5 49.75,37.75 56,37.75 56.5,38.25 68.5,38.25 69,38.75 77.25,38.75 79.25,36.75 94.75,36.75 v96.5,35 | v96.5,19 82,19
BD6  (via drill 0.3)
  Top 0.152: U2.18 40,36 40,35.5 41.75,35.5 42.25,36 42.25,38.5 43,39.25 43,39.75 42.5,40.25 42.5,45.25 41.25,46.5 41.25,55.75 v41.5,56 41.75,56.25 v41.75,64.25 | 69.5,65 69.5,61 69.75,60.75 69.75,59.5 69.5,59.25 69.5,56 71.5,54 71.5,46.5 71.75,46.25 71.75,45 71.25,44.5 71.25,17.25 v71.5,17 | 69.5,65 69.5,67.5 71,69 U10.6 | 69.5,65 v69,65
  Bottom 0.152: v41.5,56 38.5,56 38,56.5 U4.17 | 71.5,16.75 72.25,16.75 72.5,17 75,17 75.5,17.5 U1.11 | 71.5,16.75 68.25,16.75 68,17 65.5,17 65.5,14 66,13.5 68.25,13.5 69,12.75 U3.12 | 71.5,16.75 v71.5,17 | v41.75,64.25 43.25,65.75 56.5,65.75 57,65.25 60.25,65.25 60.5,65 v69,65
BD7  (via drill 0.3)
  Top 0.152: v71.25,14.25 71.25,12.25 69.25,10.25 U3.11 | U2.19 39.75,33.75 38.5,33.75 38.5,34.75 37.5,35.75 37.5,45.25 37.75,45.5 37.75,47 36.25,48.5 36.25,52.5 37.75,54 U4.18 | v43,62.75 42.25,62 v42.25,54.5 | v77,63.25 77,45.25 79,43.25 79,25 79.5,24.5 79.5,18.75 75.75,15 U1.12
  Bottom 0.152: v71.25,14.25 71.75,14.75 75.5,14.75 U1.12 | v43,62.75 46.75,62.75 47,63 62.5,63 63.5,64 U10.11 63.75,64 69.25,64 70.25,63 76.75,63 v77,63.25 | v42.25,54.5 42,54.25 38,54.25 U4.18
D0  (via drill 0.3)
  Top 0.152: v55.75,6 54.5,7.25 v54.5,8.5 | v51,8.75 50.75,9 v50.75,30
  Bottom 0.152: v55.75,6 57.25,6 57.25,4.5 U$1.A14 | v54.5,8.5 54.25,8.75 v51,8.75 | v50.75,30 58,30 58.5,30.5 61.5,30.5 U3.2
D1  (via drill 0.3)
  Top 0.152: v57.75,9.25 58,9 58,8.25 57.75,8 57.75,4.75 57.5,4.5 U$1.B14 | v48.5,9.25 48,9.75 v48,27.75
  Bottom 0.152: v57.75,9.25 51.5,9.25 51.25,9.5 48.75,9.5 v48.5,9.25 | v48,27.75 48.25,27.5 57,27.5 58,28.5 61,28.5 61.5,28 U3.3
D2  (via drill 0.3)
  Top 0.152: v56.25,5.25 56.5,5.5 v56.5,14.25 | v59.25,14.5 59,14.75 59,22.75 61.5,25.25 U3.4
  Bottom 0.152: v56.25,5.25 55.75,5.25 55,4.5 U$1.A15 | v56.5,14.25 56.75,14.5 v59.25,14.5
D3  (via drill 0.3)
  Top 0.152: v53.5,16.75 53.25,16.5 53.25,10.5 53.75,10 53.75,5.5 54.75,4.5 U$1.B15 | v59.75,17 60,17.25 60,21.25 61.5,22.75 U3.5
  Bottom 0.152: v53.5,16.75 53.75,17 v59.75,17
D4  (via drill 0.3)
  Top 0.152: v53,6 52.75,6.25 52.75,17 53,17.25 v53,20
  Bottom 0.152: v53,6 52.5,6 52.5,4.5 U$1.A16 | v53,20 61.25,20 61.5,20.25 U3.6
D5  (via drill 0.3)
  Top 0.152: v52.25,17.5 52.25,4.5 U$1.B16
  Bottom 0.152: v52.25,17.5 59.25,17.5 59.5,17.75 61.5,17.75 U3.7
D6  (via drill 0.3)
  Top 0.152: v51.5,6 51.75,6.25 51.75,14.5 v51.5,14.75
  Bottom 0.152: v51.5,6 50,4.5 U$1.A17 | v51.5,14.75 56,14.75 56.5,15.25 61.5,15.25 U3.8
D7  (via drill 0.3)
  Top 0.152: v50.5,6 50.5,5 50,4.5 U$1.B17 | v59.25,12.75 v59.25,6.5
  Bottom 0.152: v50.5,6 51.25,6.75 59,6.75 v59.25,6.5 | v59.25,12.75 61.5,12.75 U3.9
DIRECTION  (via drill 0.3)
  Top 0.152: v29.25,63.25 29.25,69 33,69 U12.6 | v1.25,60.5 1.5,60.25 1.5,40.5 3.5,38.5 X1.18
  Bottom 0.152: v29.25,63.25 26.5,60.5 v1.25,60.5
DISKCHANGE  (via drill 0.3)
  Top 0.152: 12,32.75 11.75,32.5 v11.75,20.75 | 12,32.75 13.5,34.25 13.5,39 14.25,39.75 R5.2 | v11.25,70.75 12,70 12,32.75
  Bottom 0.152: v11.75,20.75 10.25,19.25 4.75,19.25 3.75,18.25 X1.2 | v11.25,70.75 11.5,70.5 35.25,70.5 35.5,70.25 47,70.25 47,69.25 48.75,67.5 49.25,67.5 49.5,67.75 60.25,67.75 60.5,67.5 70.25,67.5 71,66.75 U10.5
DISKCHANGERESET
  Bottom 0.152: U11.12 14.5,18.25 6.25,18.25 X1.1
EXP  (via drill 0.3)
  Top 0.152: v9.75,38.75 9.75,8.75 14,4.5 U$1.B31 | v48.25,45 48,45.25 48,60.5 49,61.5 v49,68.25
  Bottom 0.152: v9.75,38.75 16,45 44.25,45 44.5,45.25 45.5,45.25 46,44.75 48,44.75 v48.25,45 | v49,68.25 62.5,68.25 62.75,68 76.5,68 80.5,64 80.5,63 78.25,63 77.25,64 75,64 U6.11
GND  (via drill 0.3)
  Top 0.3: U5.7 60,36.75 60,39 U5.6 59.75,39.25 58,41 v58,43.5 | U7.6 26.75,48.75 26.75,51 U7.7 | v49.75,44.5 49.75,50 C2.2 | C4.2 44.25,8.75 44.5,8.5 44.5,4.5 U$1.B19 44.5,4.25 42.25,4.25 U$1.B20 42,4.25 39.75,4.25 U$1.B21 39.5,4.25 37.25,4.25 U$1.B22 37,4.25 34.75,4.25 U$1.B23 34.5,4.5 33.25,5.75 33.25,21.75 34.75,23.25 U9.5 | v13,4.25 11.75,4.25 U$1.B32 11.5,4.5 7.25,8.75 7.25,19.5 6.25,20.5 X1.3 6.25,20.75 6.25,23 X1.5 6.25,23.25 6.25,25.75 X1.7 6.25,26 6.25,28.25 X1.9 6.25,28.5 6.25,30.75 X1.11 6.25,31 6.25,33.25 X1.13 6.25,33.5 6.25,35.75 X1.15 6.25,36 6.25,38.25 X1.17 6.25,38.5 6.25,41 X1.19 6.25,41.25 6.25,43.5 X1.21 6.25,43.75 6.25,46 X1.23 6.25,46.25 6.25,48.5 X1.25 6.25,48.75 6.25,51 X1.27 6.25,51.25 6.25,53.5 X1.29 6.25,53.75 6.25,56.25 X1.31 6.25,56.5 6.25,58.75 X1.33 | 35,28.5 U9.7 | U11.7 22.5,28.5 23.5,29.5 23.5,32.75 C7.2 | 82.5,70.5 82.5,71.5 U6.7 | 82.5,70.5 82.5,69.25 U6.6 | 66.75,72.75 66.75,59.5 67.5,58.75 67.5,54.25 C8.2 | 66.75,72.75 67.25,73.25 71,73.25 71,71.75 U10.7 | 71.25,71.75 U10.7 | 82.5,70.5 71.25,70.5 71.25,71.5 U10.7 | 33,71.75 U12.7 | 45.5,72 U4.10 | C9.2 57.25,54.75 57.25,69.75 59.25,71.75 U8.7 59.5,72 59.5,72.75 66.75,72.75 | 61.75,10.25 U3.10 | C1.- 92,46.25 91,47.25 91,49.5 C11.2 | v84.25,10.75 v84.25,39.25 84.25,42.5 85.75,44 85.75,47.75 85.5,48 C12.- 85.25,48.25 85.25,65.75 89.25,69.75 IC1.2
  Bottom 0.3: U5.6 60,39.25 67.5,39.25 U5.9 67.75,39.25 v84.25,39.25 | 30.25,53.75 29.75,53.25 28.75,53.25 26.75,51.25 U7.7 26.5,51.25 24.75,53 8,53 6.25,51.25 X1.27 | 30.25,53.75 30.5,54 C6.2 30.25,53.75 | v49.75,44.5 54.25,44.5 54.75,44 U2.14 55,43.75 57.75,43.75 v58,43.5 | 30.25,53.75 33.5,50.5 49.25,50.5 49.5,50.25 C2.2 | C10.2 16.5,10.25 17.5,11.25 28,11.25 29,10.25 C5.2 29.25,10 30,9.25 43.75,9.25 44,9 C4.2 | U$1.A30 16.75,4.25 14.25,4.25 U$1.A31 14,4.25 v13,4.25 | 33.25,27.25 33.25,28.25 34.75,28.25 U9.7 | 33.25,27.25 33.25,25 34.75,23.5 U9.5 | 33.25,27.25 23.5,27.25 22.5,28.25 U11.7 | C7.2 23.5,32.75 21.5,30.75 6.25,30.75 X1.11 | U6.7 82.5,71.75 83,72.25 87,72.25 89.25,70 IC1.2 | U12.7 33.25,71.75 34.5,73 44.25,73 45.25,72 U4.10 45.5,72 46.25,72.75 58.5,72.75 59.25,72 U8.7 | U3.10 61.75,10.25 66.75,10.25 67.75,11.25 74.25,11.25 75.5,10 U1.14 75.75,10 76.5,10.75 v84.25,10.75 | C12.- 85.5,48.25 85.75,48.5 89.75,48.5 90.75,49.5 C11.2 91,49.75 92,49.75 92,56.25 90.5,57.75 83.5,57.75 82.5,58.75 U6.2 | C3.2 82.25,44.25 83.25,43.25 89.25,43.25 90,44 93.5,44 94.5,43 95,43 95.75,43.75 95.75,46 92.25,46 C1.-
  pour Top (isolate 0.61): 0,74.3 98.93,74.3 98.93,0.38 0,0.38
  pour Bottom (isolate 0.61): 0.13,74.3 98.81,74.3 98.81,0.25 0.13,0.25
INDEXPULSE  (via drill 0.3)
  Top 0.152: v50,31.25 v50,23.5 | v64.75,35.25 v64.75,33.25
  Bottom 0.152: 94.25,34 94.5,34 R8.1 94.25,34 | 94.25,34 92,34 91,33 U1.24 | v50,23.5 48.5,22 38.75,22 38.5,21.75 20,21.75 18,19.75 13.75,19.75 11.75,21.75 2.25,21.75 2.25,24.5 3.5,25.75 X1.8 | v50,31.25 51,32.25 60.25,32.25 60.5,32 63.5,32 v64.75,33.25 | v64.75,35.25 73.75,35.25 74.75,36.25 77.75,36.25 78,36 89.75,36 90,36.25 92,36.25 94.25,34
INUSE  (via drill 0.3)
  Top 0.152: v27.75,58.75 27,58 27,54.75 24.25,52 v24.25,50.25 | v5.5,34.75 4.75,34 4.75,21.75 3.75,20.75 X1.4
  Bottom 0.152: v27.75,58.75 33,58.75 U12.2 | v24.25,50.25 24,50.5 22.25,50.5 20.25,52.5 13,52.5 7.25,46.75 7.25,34.75 v5.5,34.75
IORQ  (via drill 0.3)
  Top 0.152: v86.5,30.5 86.5,5.5 85.5,4.5 U$1.B3
  Bottom 0.152: v86.5,30.5 83.5,33.5 77,33.5 76.75,33.75 70.5,33.75 70.25,34 63.75,34 63,34.75 49.25,34.75 47.25,32.75 25.25,32.75 23.25,34.75 13.75,34.75 10.5,38 9.5,38 9,38.5 9,47.75 18.25,47.75 19,48.5 U7.9
MOTORON
  Top 0.152: U12.8 25.25,71.75 23.75,73.25 4.5,73.25 4.5,67.5 0.5,63.5 0.5,39 3.5,36 X1.16
MREQ  (via drill 0.3)
  Top 0.152: v80.5,6.25 81.5,7.25 81.5,16.5 82,17 82,40.5 81.5,41 81.5,42.5 83,44 83,47.25 81.5,48.75 81.5,51.25 78.75,54 v78.75,63.75 | v55.5,67 55.25,67.25 v55.25,71 | v36.25,71 34.75,69.5 34.75,68.75 33.5,67.5 30.75,67.5 30.75,55.25 31.5,54.5 31.5,49.25 30,47.75 v30,42.75
  Bottom 0.152: v80.5,6.25 80.5,4.5 U$1.A5 | v78.75,63.75 77,65.5 69.5,65.5 69.25,65.75 64.75,65.75 64.5,65.5 60.75,65.5 60.5,65.75 57.25,65.75 56,67 v55.5,67 | v55.25,71 55,70.75 36.5,70.75 v36.25,71 | v30,42.75 28.25,41 26.75,41 U7.3
N$1  (via drill 0.3)
  Top 0.152: v31.5,65.75 31.5,63 33,61.5 U12.3 | v20.25,65.5 19.5,64.75 19.5,53.25 22.25,50.5 v22.25,39 | v48.25,34.75 48.75,34.25 v48.75,15.25
  Bottom 0.152: v31.5,65.75 31.25,65.5 v20.25,65.5 | v22.25,39 24.5,36.75 37.25,36.75 39.25,34.75 v48.25,34.75 | v48.75,15.25 50,14 52.25,14 54,12.25 58.75,12.25 59.25,11.75 66.25,11.75 66.5,12 68,12 68.25,11.75 74.5,11.75 74.75,11.5 90,11.5 90.75,12.25 U1.16
N$2  (via drill 0.3)
  Top 0.152: v32,48.75 32,54.75 31.5,55.25 31.5,60 33.5,60 34.75,61.25 34.75,65 33.25,66.5 U12.5 | v47.25,49.25 47.5,49 v47.5,29.75 | v89.5,26.5 89.25,26.25 89.25,16.5 90.75,15 U1.17
  Bottom 0.152: v32,48.75 32.75,48 41.75,48 43.75,50 46.5,50 v47.25,49.25 | v47.5,29.75 48,29.25 53.75,29.25 54,29.5 58,29.5 58.5,29 65,29 67.5,26.5 v89.5,26.5
N$3  (via drill 0.3)
  Top 0.152: v72.75,30.75 73,31 73,52 72.75,52.25 R3.2 72.75,52.5 72.75,56.75 73.25,57.25 | 73.25,57.25 74.75,58.75 U6.13 | 73.25,57.25 73.25,65 74.75,66.5 U6.10
  Bottom 0.152: v72.75,30.75 69.5,30.75 69.25,30.5 U3.19
N$5  (via drill 0.3)
  Top 0.152: v70,42 70.5,42.5 70.5,46 R2.2 | 60,45.25 60,46.75 U5.3 | 60,45.25 60,44.5 U5.4 | v61.75,63.75 62,63.5 62,55.75 63.25,54.5 63.25,45.75 62.75,45.25 60,45.25
  Bottom 0.152: v70,42 67.75,42 U5.10 | v61.75,63.75 59.75,63.75 59.5,64 U8.4 | R2.2 70.5,46 70.25,45.75 63.75,45.75 62.75,46.75 60,46.75 U5.3
N$6  (via drill 0.3)
  Top 0.152: v57.75,49.75 58.25,50.25 58.25,55.5 57.75,56 57.75,65 59.25,66.5 U8.5
  Bottom 0.152: v57.75,49.75 52,49.75 49.75,47.5 20.75,47.5 19.25,46 U7.10
N$7  (via drill 0.3)
  Top 0.152: v78.25,46.75 77.75,47.25 77.75,65.5 75.25,68 72.75,68 72.75,69.5 72.25,70 68.25,70 v68.25,69.25
  Bottom 0.152: v78.25,46.75 82.25,42.75 90.75,42.75 U1.28 | v68.25,69.25 63.75,69.25 U10.9
N$8  (via drill 0.3)
  Top 0.152: v8.25,29.5 v8.25,63.75 | v59,27.75 60,28.75 60,34 64.75,38.75 64.75,41 65.25,41.5 66,41.5 66,41.25 66.25,41 66.25,40 66,39.75 v66,29.75
  Bottom 0.152: v8.25,63.75 13.25,68.75 25,68.75 25.25,69 U12.9 | v8.25,29.5 19,29.5 19.25,29.25 21.25,29.25 21.5,29.5 36.75,29.5 39.25,27 57.25,27 58,27.75 v59,27.75 | v66,29.75 68,29.75 68.25,29.5 74.5,29.5 74.75,29.25 91.25,29.25 92.5,28 92.5,22.75 91,22.75 U1.20
N$9  (via drill 0.3)
  Top 0.152: v37.5,14.75 38,15.25 38,34.5 37,35.5 v37,45.75 | v42,46.75 42.25,47 42.25,48.5 45.25,51.5 U4.2
  Bottom 0.152: v37.5,14.75 24,14.75 22.5,13.25 U11.1 | v37,45.75 38,46.75 v42,46.75
N$10  (via drill 0.3)
  Top 0.152: v30.5,19.25 30.5,42.25 31.25,43 31.25,47 33.5,49.25 v33.5,51.75 | v43.75,52.5 47,52.5 47,57.5 45.5,59 U4.5
  Bottom 0.152: v30.5,19.25 23.25,19.25 22.5,18.5 U11.3 | v33.5,51.75 34.25,52.5 v43.75,52.5
N$11  (via drill 0.3)
  Top 0.152: v24.5,30.25 24.5,25.5 22.5,23.5 U11.5 | v29.25,32 29.25,52 29,52.25 29,62.5 28.5,63 28.5,69 32.5,73 47,73 47,63.25 45.5,61.75 U4.6
  Bottom 0.152: v24.5,30.25 26.25,32 v29.25,32
N$12  (via drill 0.3)
  Top 0.152: v15.5,63.75 15.5,56.5 16,56 16,38.5 15.75,38.25 15.75,35 13,32.25 13,27.5 14.5,26 U11.9
  Bottom 0.152: v15.5,63.75 18.5,66.75 23.5,66.75 24.75,68 36.25,68 36.5,68.25 44.25,68.25 45.25,69.25 U4.9
N$13  (via drill 0.3)
  Top 0.152: v9,65.5 v9,26
  Bottom 0.152: v9,26 9.5,26 14.5,21 U11.11 | v9,65.5 13.5,70 35,70 35.5,69.5 37.75,69.5 U4.12
N$14  (via drill 0.3)
  Top 0.152: v16.25,56.75 16.5,56.5 16.5,38.25 16.25,38 16.25,17.25 14.75,15.75 U11.13
  Bottom 0.152: v16.25,56.75 21.5,56.75 23.75,59 23.75,60 34.5,60 35.25,59.25 37.75,59.25 U4.16
N$15  (via drill 0.3)
  Top 0.152: v34.5,51.75 33.25,53 33.25,56.25 U12.1
  Bottom 0.152: v34.5,51.75 37.75,51.75 U4.19
N$16  (via drill 0.3)
  Top 0.152: v56.5,61.75 56.75,62 v56.75,71
  Bottom 0.152: v56.5,61.75 59.25,61.75 U8.3 | v56.75,71 56,71.75 51.75,71.75 U8.8
N$17  (via drill 0.3)
  Top 0.152: v12.75,34.75 13,35 13,72.75 22.5,72.75 23.25,72 23.25,66.25 25.25,64.25 U12.11 | v18.5,32 20.25,30.25 v20.25,21
  Bottom 0.152: v12.75,34.75 15.5,32 v18.5,32 | v20.25,21 21.5,19.75 30,19.75 30.25,20 33.75,20 34.25,19.5 44.75,19.5 45.75,20.5 52.5,20.5 54,22 60.5,22 61.25,21.25 78.25,21.25 82,25 90.75,25 U1.21
N$18  (via drill 0.3)
  Top 0.152: v72,44.25 72.25,44.5 v72.25,49.25 | U6.4 82.5,64 82.5,61.5 U6.3 | v69,60.5 69,53.75 69.25,53.5 69.25,50 70,49.25 R1.1
  Bottom 0.152: v72,44.25 67.75,44.25 U5.11 | v72.25,49.25 70.25,49.25 R1.1 | U8.2 59.5,59.25 60.75,60.5 v69,60.5 81.5,60.5 82.25,61.25 U6.3
N$19  (via drill 0.3)
  Top 0.152: v44.25,32 44.5,32.25 44.5,43.75 43.75,44.5 43.75,49.25 45,50.5 47.5,50.5 v47.5,61 47.5,67.75 v49,69.25
  Bottom 0.152: v44.25,32 40.75,32 40,31.25 U2.20 | v47.5,61 48,61.5 51.5,61.5 U8.12 | v49,69.25 50,70.25 57,70.25 57.25,70.5 66.5,70.5 68.75,72.75 76.5,72.75 76.5,70.75 75,69.25 U6.9
N$20  (via drill 0.3)
  Top 0.152: v32.75,36 35.25,38.5 v35.25,60.25
  Bottom 0.152: v32.75,36 26.75,36 U7.1 | v35.25,60.25 50.5,60.25 51.5,59.25 U8.13
N$21  (via drill 0.3)
  Top 0.152: v88,28.5 87.25,29.25 v87.25,51.75 | v28.25,55.25 28.5,55.5 28.5,59 28,59.5 25.5,59.5 25.5,59 U12.13
  Bottom 0.152: v88,28.5 90,28.5 90.75,27.75 U1.22 | v87.25,51.75 84.25,54.75 70.75,54.75 69.25,56.25 65.5,56.25 64.5,55.25 58,55.25 57.5,55.75 53,55.75 52.5,55.25 v28.25,55.25
N$22  (via drill 0.3)
  Top 0.152: 27,25.5 27.25,25.75 U9.9 27,25.5 | 27,25.5 25.75,24.25 25.75,22.5 27.25,21 U9.11 | v23,41.5 24.25,40.25 24.25,33.75 25.25,32.75 25.25,27.25 27,25.5
  Bottom 0.152: v23,41.5 21,41.5 19.25,43.25 U7.11
N$23  (via drill 0.3)
  Top 0.152: v28.5,51.25 28.75,51 28.75,35.25 28.5,35 28.5,31.75 29.5,30.75 29.5,17.75 27.5,15.75 U9.13 | v29.75,52.5 29.5,52.75 29.5,60.25 v30,60.75 | v55.25,65 56.25,66 56.25,68.75 v56,69
  Bottom 0.152: U9.13 27.5,15.75 34.75,15.75 U9.2 | U6.8 74.75,71.5 73.25,70 60.25,70 59.5,69.25 U8.6 59.25,69 v56,69 | v29.75,52.5 v28.5,51.25 | v30,60.75 32.25,63 41.5,63 43.75,65.25 55,65.25 v55.25,65
N$24  (via drill 0.3)
  Top 0.152: v42.75,17.5 42.5,17.75 42.5,24.25 42.75,24.5 42.75,38.25 43.5,39 43.5,42 v43.25,42.25 | v50.25,42.25 51,43 v51,51 | v75.5,49 75.5,43 U1.1
  Bottom 0.152: v42.75,17.5 35.75,17.5 35,18.25 U9.3 | v50.25,42.25 v43.25,42.25 | v51,51 52.25,52.25 58.25,52.25 59,53 64.5,53 66.5,51 71.75,51 72,50.75 73.75,50.75 v75.5,49
N$25  (via drill 0.3)
  Top 0.152: v25.25,46.75 25.25,47 27.75,47 28.25,46.5 28.25,35.5 28,35.25 28,29 27.5,28.5 U9.8 | v36,46.75 35.75,47 35.75,59.75 36.25,60.25 36.25,70 37.75,71.5 37.75,71.75 U4.11
  Bottom 0.152: v25.25,46.75 25.5,47 35.75,47 v36,46.75
N$26  (via drill 0.3)
  Top 0.152: v18.25,53.75 17.5,53 17.5,40 19,38.5 U7.13 | U10.10 63.75,66.5 65.25,65 65.25,60.5 63.75,59 U10.13 | U10.4 72.75,62.5 72.75,58 71.25,56.5 U10.1
  Bottom 0.152: v18.25,53.75 20.75,56.25 23.25,56.25 25,58 36.25,58 36.5,58.25 50.5,58.25 50.75,58 62.75,58 63.5,58.75 U10.13 63.75,58.75 66,58.75 68,56.75 70.75,56.75 71,56.5 U10.1
N$27  (via drill 0.3)
  Top 0.152: v68.25,59.75 v68.25,62
  Bottom 0.152: v68.25,62 64.25,62 63.75,61.5 U10.12 | v68.25,59.75 70,59.75 70.25,60 89,60 96.25,52.75 96.25,40.5 91,40.5 U1.27
N$28  (via drill 0.3)
  Top 0.152: v32.75,33.5 33.25,33 33.25,27.5 34.75,26 U9.6 | v41.5,31 41.5,27.75 40,26.25 U2.22 | v49,43 49,45.25 48.5,45.75 48.5,60 52,60 53.25,61.25 53.25,62.5 51.75,64 U8.11
  Bottom 0.152: U9.6 35,26 39.75,26 U2.22 | v32.75,33.5 26.5,33.5 19.25,40.75 U7.12 19.25,41 22,41 23,40 29.75,40 32.75,43 38.5,43 38.75,42.75 40.75,42.75 41,43 v49,43 | v41.5,31 46.25,31 48,32.75 61.25,32.75 61.5,33 U3.1
N$42  (via drill 0.3)
  Top 0.152: v31.75,18.5 32,18.75 v32,43.25
  Bottom 0.152: v31.75,18.5 27.5,18.5 U9.12 | v32,43.25 31.75,43.5 26.75,43.5 U7.4
N$88  (via drill 0.3)
  Top 0.152: v49.75,63.75 50,63.5 v50,62.25
  Bottom 0.152: v49.75,63.75 47,63.75 46.5,63.25 44.5,63.25 44.25,63.5 42.75,63.5 41.75,62.5 38.75,62.5 38,61.75 U4.15 | v50,62.25 50.25,62.5 67.75,62.5 68,62.75 69.75,62.75 70,62.5 87.25,62.5 96.75,53 96.75,37.75 91,37.75 U1.26
RD  (via drill 0.3)
  Top 0.152: v83.25,6.25 82,7.5 82,16.25 82.5,16.75 82.5,41 v82.25,41.25 | v74.25,41.25 74,41.5 74,45.5 74.5,46 v74.5,49 | v43,48.25 43.25,48 43.25,43.25 44,42.5 44,32.75 43.25,32 v43.25,20.25
  Bottom 0.152: v83.25,6.25 83.5,6.25 85.25,4.5 U$1.A3 | v82.25,41.25 82,41.5 74.5,41.5 v74.25,41.25 | v74.5,49 73.25,50.25 68.75,50.25 68.5,50.5 51.5,50.5 49,48 43.25,48 v43,48.25 | v43.25,20.25 43,20 35.75,20 35,20.75 U9.4
READDATA  (via drill 0.3)
  Top 0.152: v78.75,20.75 78.25,21.25 v78.25,36.75 | v21.5,40.25 20.75,41 20.75,51.25 19,53 19,65.25 20,66.25 21,66.25 21,57.75 R6.1
  Bottom 0.152: R6.1 21,57.75 18.75,60 3.25,60 2.5,59.25 2.5,53.75 3.5,53.75 X1.30 | v78.75,20.75 90.25,20.75 90.75,20.25 U1.19 | v78.25,36.75 69.5,36.75 68.5,35.75 65.25,35.75 65,36 61.25,36 61,35.75 57.5,35.75 56,37.25 52.25,37.25 52,37 41,37 40.75,37.25 25,37.25 22,40.25 v21.5,40.25
READY  (via drill 0.3)
  Top 0.152: v9.25,71.5 4.25,66.5 4.25,59.5 3.75,59 X1.34 | v68.25,58.75 67.5,59.5 v67.5,72.5
  Bottom 0.152: v9.25,71.5 12,71.5 R4.2 12.25,71.75 14,73.5 66.5,73.5 v67.5,72.5 | v68.25,58.75 71,58.75 U10.2
RESET  (via drill 0.3)
  Top 0.152: v47.25,6.5 45.5,8.25 v45.5,19.25 45.5,49 U4.1 | v66.25,14.25 66,14.5 v66,19.25
  Bottom 0.152: v47.25,6.5 47.25,4.5 U$1.A18 | v66.25,14.25 69.75,14.25 71,13 75,13 75.5,12.5 U1.13 | v66,19.25 56.25,19.25 56,19.5 53.5,19.5 53.25,19.25 v45.5,19.25
SELECT0  (via drill 0.3)
  Top 0.152: v5.5,14.75 2.5,17.75 2.5,27.25 3.5,28.25 X1.10
  Bottom 0.152: v5.5,14.75 21.5,14.75 22.25,15.5 U11.2
SELECT1  (via drill 0.3)
  Top 0.152: v19.5,30 19.5,20.25 20.5,20.25 21,20.75 22.25,20.75 U11.4
  Bottom 0.152: v19.5,30 19.25,30.25 7,30.25 6.5,29.75 4.75,29.75 3.75,30.75 X1.12
SELECT2  (via drill 0.3)
  Top 0.152: v20.75,31.5 20.75,27.5 22.25,26 U11.6
  Bottom 0.152: v20.75,31.5 20.5,31.25 7.25,31.25 6.25,32.25 4.75,32.25 3.75,33.25 X1.14
SELECT3
  Bottom 0.152: U11.8 14.5,28.25 14,27.75 9.75,27.75 6.5,24.5 5,24.5 3.75,23.25 X1.6
SIDE1  (via drill 0.3)
  Top 0.152: v10.5,55.75 10.5,16.75 12.75,16.75 13.25,17.25 13.25,17.75 13,18 13,21.75 14.5,23.25 U11.10
  Bottom 0.152: v10.5,55.75 8.75,57.5 4.75,57.5 3.75,56.5 X1.32
STEP  (via drill 0.3)
  Top 0.152: v2,62.25 2,42.75 3.5,41.25 X1.20
  Bottom 0.152: v2,62.25 3.75,62.25 4,62.5 26,62.5 27.5,64 33,64 U12.4
TRACK0  (via drill 0.3)
  Top 0.152: v11,72.25 4.75,66 4.75,49.75 3.75,48.75 X1.26
  Bottom 0.152: R9.1 14.25,57.5 11.75,55 5.75,55 4.75,54 4.75,52.75 4.25,52.75 3.75,52.25 3,52.25 2.5,51.75 2.5,48.75 3.5,48.75 X1.26 | v11,72.25 12.75,74 90.25,74 94.25,70 97.25,70 97.25,34.75 95.5,33 93.75,33 91,30.25 U1.23
WR  (via drill 0.3)
  Top 0.152: v92.5,38.5 92.5,9 88,4.5 U$1.B2 | U9.10 27.5,23.5 29,25 29,26.25 27.75,27.5 25.75,27.5 25.75,34.75 25,35.5 v25,39 25,40.25 24.5,40.75 24.5,49 20,53.5 20,63 v20.25,63.25
  Bottom 0.152: v92.5,38.5 91.75,39.25 85.25,39.25 84.25,40.25 75.75,40.25 U1.2 75.5,40.25 66.5,40.25 66.25,40 65.25,40 65,40.25 39.25,40.25 38.5,39.5 25.5,39.5 v25,39 | v20.25,63.25 22,65 34,65 36.75,67.75 46.5,67.75 47.25,67 51.25,67 51.5,66.75 U8.10
WRITEDATA
  Bottom 0.152: U12.12 25.25,61.5 1.25,61.5 0.5,60.75 0.5,43.75 3.5,43.75 X1.22
WRITEGATE  (via drill 0.3)
  Top 0.152: v3.5,63 2.75,62.25 2.75,59.5 2.5,59.25 2.5,47.25 3.5,46.25 X1.24
  Bottom 0.152: v3.5,63 15.75,63 19,66.25 25,66.25 25.25,66.5 U12.10
WRITEPROTECT  (via drill 0.3)
  Top 0.152: v81.25,35 81.5,34.75 81.5,19.5 v81.25,19.25 | v66.75,16.25 67,16 67,11.5 v66.75,11.25
  Bottom 0.152: R7.1 17.75,57.5 15.75,57.5 11.75,53.5 7.5,53.5 6.25,52.25 4.75,52.25 3.75,51.25 X1.28 3.75,51 4.75,51 4.75,43.25 4,42.5 1.75,42.5 1.75,17.5 7.5,11.75 56,11.75 56.5,11.25 v66.75,11.25 | v81.25,35 90.5,35 90.75,35.25 U1.25 | v81.25,19.25 78.5,16.5 72.75,16.5 72.5,16.25 v66.75,16.25

### Text on the board
tNames: FLOPPY CONTROLLER / FOR ENTERPRISE COMPUTER / (VADERETRO - 2016) | INTELLIGENT SOFTWARE | COMPUTERS | ENTERPRISE